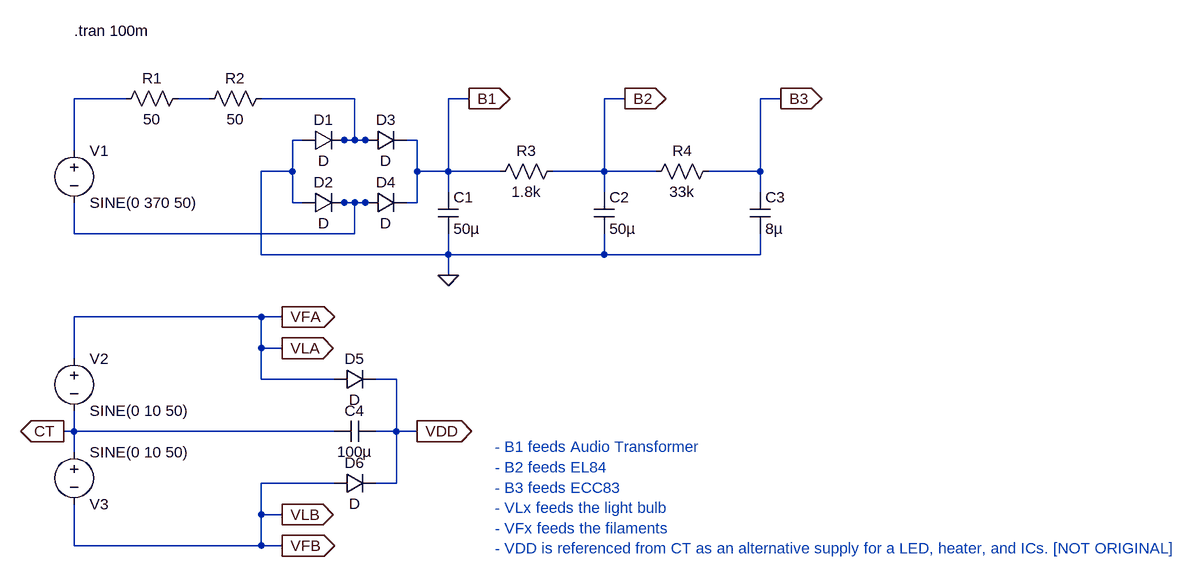
[diagram p0: schematic PowerSupply.asc]
PowerSupply.asc, the LTspice schematic file:
Version 4.1
SHEET 1 1728 840
WIRE 32 64 -48 64
WIRE 160 64 112 64
WIRE 384 64 240 64
WIRE 560 64 528 64
WIRE 800 64 768 64
WIRE 1040 64 1008 64
WIRE 304 128 288 128
WIRE 368 128 352 128
WIRE 384 128 384 64
WIRE 384 128 368 128
WIRE 400 128 384 128
WIRE 416 128 400 128
WIRE 480 128 464 128
WIRE -48 144 -48 64
WIRE 288 176 288 128
WIRE 288 176 240 176
WIRE 480 176 480 128
WIRE 528 176 528 64
WIRE 528 176 480 176
WIRE 608 176 528 176
WIRE 768 176 768 64
WIRE 768 176 688 176
WIRE 848 176 768 176
WIRE 1008 176 1008 64
WIRE 1008 176 928 176
WIRE 528 208 528 176
WIRE 768 208 768 176
WIRE 1008 208 1008 176
WIRE 288 224 288 176
WIRE 304 224 288 224
WIRE 368 224 352 224
WIRE 384 224 368 224
WIRE 400 224 384 224
WIRE 416 224 400 224
WIRE 480 224 480 176
WIRE 480 224 464 224
WIRE -48 272 -48 224
WIRE 384 272 384 224
WIRE 384 272 -48 272
WIRE 240 304 240 176
WIRE 528 304 528 272
WIRE 528 304 240 304
WIRE 768 304 768 272
WIRE 768 304 528 304
WIRE 1008 304 1008 272
WIRE 1008 304 768 304
WIRE 528 336 528 304
WIRE 240 400 -48 400
WIRE 272 400 240 400
WIRE 240 448 240 400
WIRE 272 448 240 448
WIRE -48 464 -48 400
WIRE 240 496 240 448
WIRE 352 496 240 496
WIRE 448 496 416 496
WIRE -48 576 -48 544
WIRE -48 576 -64 576
WIRE 352 576 -48 576
WIRE 448 576 448 496
WIRE 448 576 416 576
WIRE 480 576 448 576
WIRE -48 608 -48 576
WIRE 352 656 240 656
WIRE 448 656 448 576
WIRE 448 656 416 656
WIRE 240 704 240 656
WIRE 272 704 240 704
WIRE -48 752 -48 688
WIRE 240 752 240 704
WIRE 240 752 -48 752
WIRE 272 752 240 752
FLAG 528 336 0
FLAG 560 64 B1
IOPIN 560 64 Out
FLAG 800 64 B2
IOPIN 800 64 Out
FLAG 1040 64 B3
IOPIN 1040 64 Out
FLAG 272 400 VFA
IOPIN 272 400 Out
FLAG -64 576 CT
IOPIN -64 576 Out
FLAG 272 448 VLA
IOPIN 272 448 Out
FLAG 272 752 VFB
IOPIN 272 752 Out
FLAG 272 704 VLB
IOPIN 272 704 Out
FLAG 480 576 VDD
IOPIN 480 576 Out
SYMBOL voltage -48 128 R0
WINDOW 123 0 0 Left 0
WINDOW 39 0 0 Left 0
SYMATTR InstName V1
SYMATTR Value SINE(0 370 50)
SYMBOL res 128 48 R90
WINDOW 0 0 56 VBottom 2
WINDOW 3 32 56 VTop 2
SYMATTR InstName R1
SYMATTR Value 50
SYMBOL res 256 48 R90
WINDOW 0 0 56 VBottom 2
WINDOW 3 32 56 VTop 2
SYMATTR InstName R2
SYMATTR Value 50
SYMBOL diode 304 144 R270
WINDOW 0 32 32 VTop 2
WINDOW 3 0 32 VBottom 2
SYMATTR InstName D1
SYMBOL diode 304 240 R270
WINDOW 0 32 32 VTop 2
WINDOW 3 0 32 VBottom 2
SYMATTR InstName D2
SYMBOL diode 400 144 R270
WINDOW 0 32 32 VTop 2
WINDOW 3 0 32 VBottom 2
SYMATTR InstName D3
SYMBOL diode 400 240 R270
WINDOW 0 32 32 VTop 2
WINDOW 3 0 32 VBottom 2
SYMATTR InstName D4
SYMBOL cap 512 208 R0
SYMATTR InstName C1
SYMATTR Value 50µ
SYMBOL res 704 160 R90
WINDOW 0 0 56 VBottom 2
WINDOW 3 32 56 VTop 2
SYMATTR InstName R3
SYMATTR Value 1.8k
SYMATTR SpiceLine tol=0.05
SYMBOL cap 752 208 R0
SYMATTR InstName C2
SYMATTR Value 50µ
SYMBOL cap 992 208 R0
SYMATTR InstName C3
SYMATTR Value 8µ
SYMBOL res 944 160 R90
WINDOW 0 0 56 VBottom 2
WINDOW 3 32 56 VTop 2
SYMATTR InstName R4
SYMATTR Value 33k
SYMATTR SpiceLine tol=0.05
SYMBOL voltage -48 448 R0
WINDOW 123 0 0 Left 0
WINDOW 39 0 0 Left 0
SYMATTR InstName V2
SYMATTR Value SINE(0 10 50)
SYMBOL voltage -48 592 R0
WINDOW 0 24 96 Left 2
WINDOW 3 24 16 Left 2
WINDOW 123 0 0 Left 0
WINDOW 39 0 0 Left 0
SYMATTR InstName V3
SYMATTR Value SINE(0 10 50)
SYMBOL diode 352 512 R270
WINDOW 0 32 32 VTop 2
WINDOW 3 0 32 VBottom 2
SYMATTR InstName D5
SYMBOL diode 352 672 R270
WINDOW 0 32 32 VTop 2
WINDOW 3 0 32 VBottom 2
SYMATTR InstName D6
SYMBOL cap 416 560 R90
WINDOW 0 0 32 VBottom 2
WINDOW 3 32 32 VTop 2
SYMATTR InstName C4
SYMATTR Value 100µ
TEXT -48 -40 Left 2 !.tran 100m
TEXT 600 600 Left 2 ;- B1 feeds Audio Transformer\n- B2 feeds EL84\n- B3 feeds ECC83\n- VLx feeds the light bulb\n- VFx feeds the filaments\n- VDD is referenced from CT as an alternative supply for a LED, heater, and ICs. [NOT ORIGINAL]

The netlist it stands for:
* PowerSupply.asc
V1 N001 N004 SINE(0 370 50)
R1 N002 N001 50
R2 N003 N002 50
D1 0 N003 D
D2 0 N004 D
D3 N003 B1 D
D4 N004 B1 D
C1 B1 0 50µ
R3 B2 B1 1.8k tol=0.05
C2 B2 0 50µ
C3 B3 0 8µ
R4 B3 B2 33k tol=0.05
V2 VLA CT SINE(0 10 50)
V3 CT VLB SINE(0 10 50)
D5 VLA VDD D
D6 VLB VDD D
C4 VDD CT 100µ
.model D D
.lib standard.dio
.tran 100m
* - B1 feeds Audio Transformer
* - B2 feeds EL84
* - B3 feeds ECC83
* - VLx feeds the light bulb
* - VFx feeds the filaments
* - VDD is referenced from CT as an alternative supply for a LED, heater, and ICs. [NOT ORIGINAL]
.backanno
.end